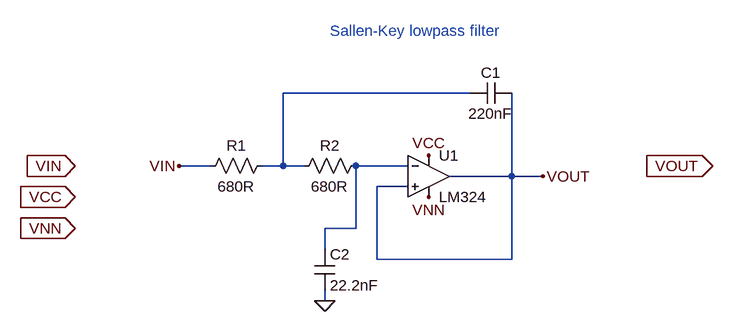
[diagram p0: schematic Lab6_Alex_Villalba.asc]
Lab6_Alex_Villalba.asc, the LTspice schematic file:
Version 4
SHEET 1 880 680
WIRE 416 -16 128 -16
WIRE 16 96 -32 96
WIRE 128 96 128 -16
WIRE 128 96 96 96
WIRE 160 96 128 96
WIRE 320 96 240 96
WIRE 480 112 480 -16
WIRE 480 112 384 112
WIRE 528 112 480 112
WIRE 320 128 272 128
WIRE 240 192 240 96
WIRE 240 192 192 192
WIRE 192 224 192 192
WIRE 272 240 272 128
WIRE 480 240 480 112
WIRE 480 240 272 240
WIRE 192 304 192 288
FLAG -192 96 VIN
IOPIN -192 96 In
FLAG 688 96 VOUT
IOPIN 688 96 Out
FLAG -192 144 VCC
IOPIN -192 144 In
FLAG -192 192 VNN
IOPIN -192 192 In
FLAG 352 80 VCC
FLAG 352 144 VNN
FLAG -32 96 VIN
FLAG 528 112 VOUT
FLAG 192 304 0
SYMBOL LM324 352 112 R0
SYMATTR InstName U1
SYMBOL res 112 80 R90
WINDOW 0 0 56 VBottom 2
WINDOW 3 32 56 VTop 2
SYMATTR InstName R1
SYMATTR Value 680R
SYMBOL res 256 80 R90
WINDOW 0 0 56 VBottom 2
WINDOW 3 32 56 VTop 2
SYMATTR InstName R2
SYMATTR Value 680R
SYMBOL cap 480 -32 R90
WINDOW 0 0 32 VBottom 2
WINDOW 3 32 32 VTop 2
SYMATTR InstName C1
SYMATTR Value 220nF
SYMBOL cap 176 224 R0
SYMATTR InstName C2
SYMATTR Value 22.2nF
TEXT 200 -112 Left 2 ;Sallen-Key lowpass filter

The netlist it stands for:
* Lab6_Alex_Villalba.asc
* U1: LM324 (symbol LM324 not available, pins judged from their places): In+=VOUT In-=N002 V+=VCC V-=VNN OUT=VOUT
R1 N001 VIN 680R
R2 N002 N001 680R
C1 VOUT N001 220nF
C2 N002 0 22.2nF
* Sallen-Key lowpass filter
.backanno
.end